# EAGLE design shema (EAGLE 9.6.2)
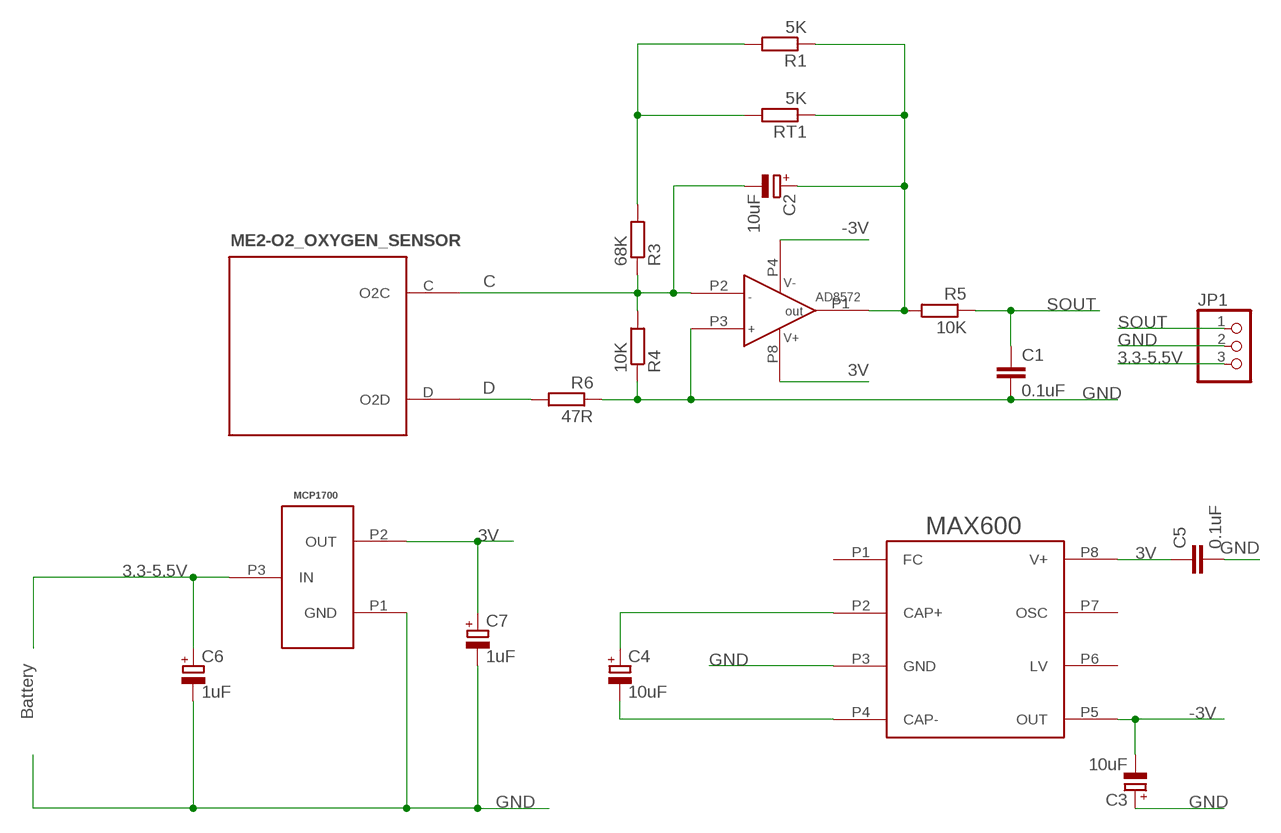
[diagram p0: schematic, sheet 1]

## Parts
AD8572  AD8572  [AD8572]
C1  0.1uF  C-EUC0603  [C0603]
C2  10uF  CPOL-EU153CLV-0405  [153CLV-0405]
C3  10uF  CPOL-EU153CLV-0405  [153CLV-0405]
C4  10uF  CPOL-EU153CLV-0405  [153CLV-0405]
C5  0.1uF  C-EUC0603  [C0603]
C6  1uF  CPOL-EU153CLV-0405  [153CLV-0405]
C7  1uF  CPOL-EU153CLV-0405  [153CLV-0405]
JP1  PINHD-1X3  [1X03]
MAX600  MAX660  [MAX660]
MCP1700  MCP1700  [MCP1700]
ME2-O2_OXYGEN_SENSOR  ME2-O2_OXYGEN_SENSOR  [ME2-O2_OXYGEN_SENSOR]
R1  5K  R-EU_R0603  [R0603]
R3  68K  R-EU_R0603  [R0603]
R4  10K  R-EU_R0603  [R0603]
R5  10K  R-EU_R0603  [R0603]
R6  47R  R-EU_R0603  [R0603]
RT1  5K  R-EU_R0603  [R0603]

## Nets
3.3-5.5V: C6.+ JP1.3 MCP1700.P3(IN)
3V: AD8572.P8(V+) C5.1 C7.+ MAX600.P8(V+) MCP1700.P2(OUT)
-3V: AD8572.P4(V-) C3.- MAX600.P5(OUT)
C: AD8572.P2(-IN) C2.- ME2-O2_OXYGEN_SENSOR.C(O2C) R3.1 R4.2
D: ME2-O2_OXYGEN_SENSOR.D(O2D) R6.2
GND: AD8572.P3(+IN) C1.2 C3.+ C5.2 C6.- C7.- JP1.2 MAX600.P3(GND) MCP1700.P1(GND) R4.1 R6.1
N$1: AD8572.P1(OUT) C2.+ R1.1 R5.2 RT1.1
N$9: R1.2 R3.2 RT1.2
N$14: C4.+ MAX600.P2(CAP+)
N$16: C4.- MAX600.P4(CAP-)
SOUT: C1.1 JP1.1 R5.1
Unconnected: MAX600.P1(FC) MAX600.P6(LV) MAX600.P7(OSC)

## Notes on the sheet
- Battery

## Library data of the parts
AD8572 = grib:AD8572
C1 C5 = rcl:C-EU: CAPACITOR, European symbol; SPICEPREFIX: C
C2-C4 C6 C7 = rcl:CPOL-EU: POLARIZED CAPACITOR, European symbol; SPICEPREFIX: C
JP1 = pinhead:PINHD-1X3: PIN HEADER
MAX600 = grib:MAX660
MCP1700 = grib:MCP1700
ME2-O2_OXYGEN_SENSOR = grib:ME2-O2_OXYGEN_SENSOR
R1 R3-R6 RT1 = rcl:R-EU_: RESISTOR, European symbol; SPICEPREFIX: R

## Board
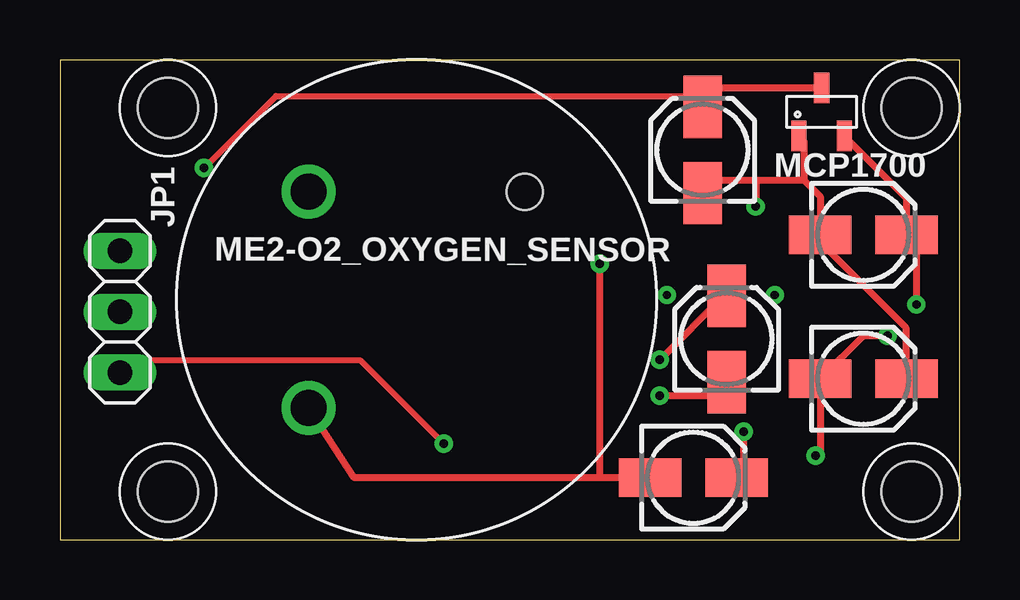
[diagram p1: board, top side]
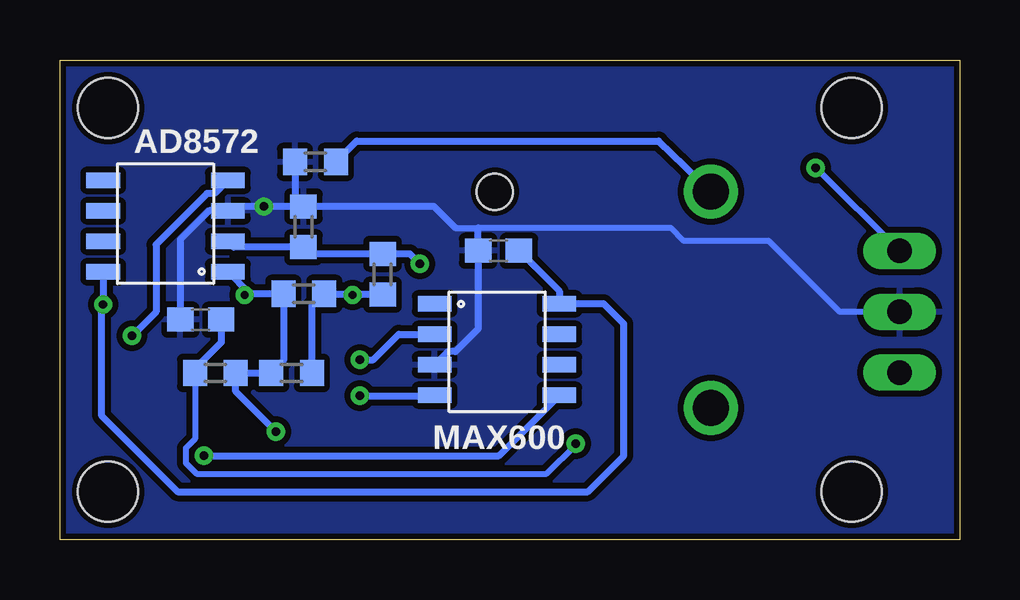
[diagram p2: board, bottom side, seen from below]

Size 37.5 x 20 mm. Coordinates in mm from the lower left corner, seen from the top.
Outline: 0,0 37.5,0 37.5,20 0,20 0,0
Copper layers (1*16): Top 0.035mm / dielectric 1.5mm / Bottom 0.035mm
Design rules "default *": minimum track width 0.25mm, minimum drill 0.35mm, track to track 0.25mm, track to pad 0.25mm, pad to pad 0.25mm, via to via 0.25mm, smd to smd 0.25mm, copper to edge 0.25mm, drill to drill 0.25mm, minimum pad ring 10mil, minimum via ring 8mil, stop-mask expansion 4mil, vias tented up to drill 0mil, thermal gap 10mil
Holes 2.5 mm at 4.5,18 4.5,2 35.5,18 35.5,2

### Footprints (pad centres in the part's own frame; a part is rotated, then mirrored left to right if it is on the bottom)
AD8572 = smd 1.4 x 0.635: P1 -2.6,2; P2 -2.6,0.73; P3 -2.6,-0.54; P4 -2.6,-1.81; P5 2.6,-1.81; P6 2.6,-0.54; P7 2.6,0.73; P8 2.6,2
C0603 = smd 1.1 x 1: 1 -0.85,0; 2 0.85,0
153CLV-0405 = smd 2.6 x 1.6: + 1.8,0; - -1.8,0
1X03 = drill 1.016 long: 1 -2.54,0; 2 0,0; 3 2.54,0
MAX660 = smd 1.4 x 0.635: P1 -2.6,2; P2 -2.6,0.73; P3 -2.6,-0.54; P4 -2.6,-1.81; P5 2.6,-1.81; P6 2.6,-0.54; P7 2.6,0.73; P8 2.6,2
MCP1700 = smd 0.635 x 1.27: P1 -0.95,-1; P2 0.95,-1; P3 0,1
ME2-O2_OXYGEN_SENSOR = drill 1.5 pad 2: C -6.364,0; D 0,6.364 | hole 1.5: 6.364,0
R0603 = smd 1 x 1.1: 1 -0.85,0; 2 0.85,0

### Placement (x,y rotation side)
AD8572  33.1,13.17 180 bottom
C1  31.63,9.17 180 bottom
C2  26.4,2.58 0 top
C3  33.49,6.71 0 top
C4  27.79,8.37 90 top
C5  19.22,12.05 180 bottom
C6  26.79,16.25 90 top
C7  33.49,12.71 0 top
JP1  2.5,9.5 90 top
MAX600  19.28,7.83 0 bottom
MCP1700  31.75,17.83 0 top
ME2-O2_OXYGEN_SENSOR  14.87,10 45 top
R1  27.33,10.25 0 bottom
R3  24.05,11.06 270 bottom
R4  27.35,13.04 270 bottom
R5  31.02,6.95 0 bottom
R6  26.85,15.75 0 bottom
RT1  27.84,6.95 0 bottom

### Tracks (layer width: path | path; a pad name or v marks a point on that pad's centre or on a via)
3.3-5.5V  (via drill 0.35)
  Top 0.25: v6,15.5 9,18.5 26.5,18.5 26.5,18.34 C6.+
  Top 0.3: MCP1700.P3 27.57,18.83 C6.+
  Bottom 0.25: JP1.3 5.96,15.5 v6,15.5
3V  (via drill 0.35)
  Top 0.3: MCP1700.P2 35.29,14.24 C7.+ 35.7,12.3 v35.7,9.8
  Bottom 0.3: C5.1 16.68,10.36 MAX600.P8 14.83,9.83 14,9 14,3.5 15.5,2 32.6,2 35.78,5.18 35.78,9.72 v35.7,9.8 AD8572.P8
-3V  (via drill 0.35)
  Top 0.3: v34.5,8.5 33.48,8.5 C3.- 31.69,3.69 v31.5,3.5
  Bottom 0.3: AD8572.P4 31.05,14.43 31.37,14.43 33.5,12.29 33.5,9.5 v34.5,8.5 | v31.5,3.5 19.2,3.5 MAX600.P5
C  (via drill 0.35)
  Top 0.3: ME2-O2_OXYGEN_SENSOR.C 12.26,2.58 C2.- 22.5,2.58 v22.5,11.5
  Bottom 0.3: AD8572.P2 30.25,12.19 R4.2 27.07,11.91 R3.1 22.91,11.91 v22.5,11.5
D
  Bottom 0.3: R6.2 25.13,16.62 12.55,16.62 ME2-O2_OXYGEN_SENSOR.D
GND  (via drill 0.35)
  Top 0.3: C6.- 27.34,15 29,15 | 29,15 31,15 | 31,15 31.69,14.31 C7.- 31.69,12.41 35.28,8.82 35.28,6.72 C3.+ | MCP1700.P1 31,16.63 31,15 | 29,15 v29,13.89
  Bottom 0.25: JP1.2 5,9.5 7.96,12.46 11.51,12.46 12.04,12.99 20.07,12.99 21.01,12.99
  Bottom 0.3: R4.1 v29,13.89 30.32,13.89 AD8572.P3 31.29,13.71 32.48,12.52 C1.2 | 20.07,12.99 C5.2 20.07,8.79 21.01,7.84 21.33,7.84 MAX600.P3 | 21.01,12.99 21.91,13.89 R4.1 | R6.1 27.7,14.24 R4.1
  pour Bottom: 0,0 0,20 37.5,20 37.5,0
N$1  (via drill 0.35)
  Top 0.3: C2.+ 28.5,2.88 v28.5,4.5
  Bottom 0.25: v29.8,10.2 29.66,10.34 29.58,10.25
  Bottom 0.3: AD8572.P1 29.58,10.25 R1.1 28.18,7.46 RT1.1 R5.2 30.17,6.17 v28.5,4.5
N$9  (via drill 0.35)
  Bottom 0.25: R1.2 25.35,10.25 v25.3,10.2
  Bottom 0.3: RT1.2 26.99,9.74 R1.2 24.09,10.25 R3.2
N$14  (via drill 0.35)
  Top 0.3: C4.+ 27.67,10.17 v25,7.5
  Bottom 0.3: v25,7.5 24.44,7.5 23.38,8.56 MAX600.P2
N$16  (via drill 0.35)
  Top 0.3: C4.- 27.22,6 v25,6
  Bottom 0.3: v25,6 21.9,6 MAX600.P4
SOUT  (via drill 0.35)
  Top 0.25: v16,4 12.54,7.46 3,7.46 JP1.1
  Bottom 0.25: R5.1 31.87,4.2 32.25,3.81 32.25,3.19 31.81,2.75 17.21,2.75 16,3.96 v16,4
  Bottom 0.3: C1.1 30.78,8.22 31.87,7.13 R5.1